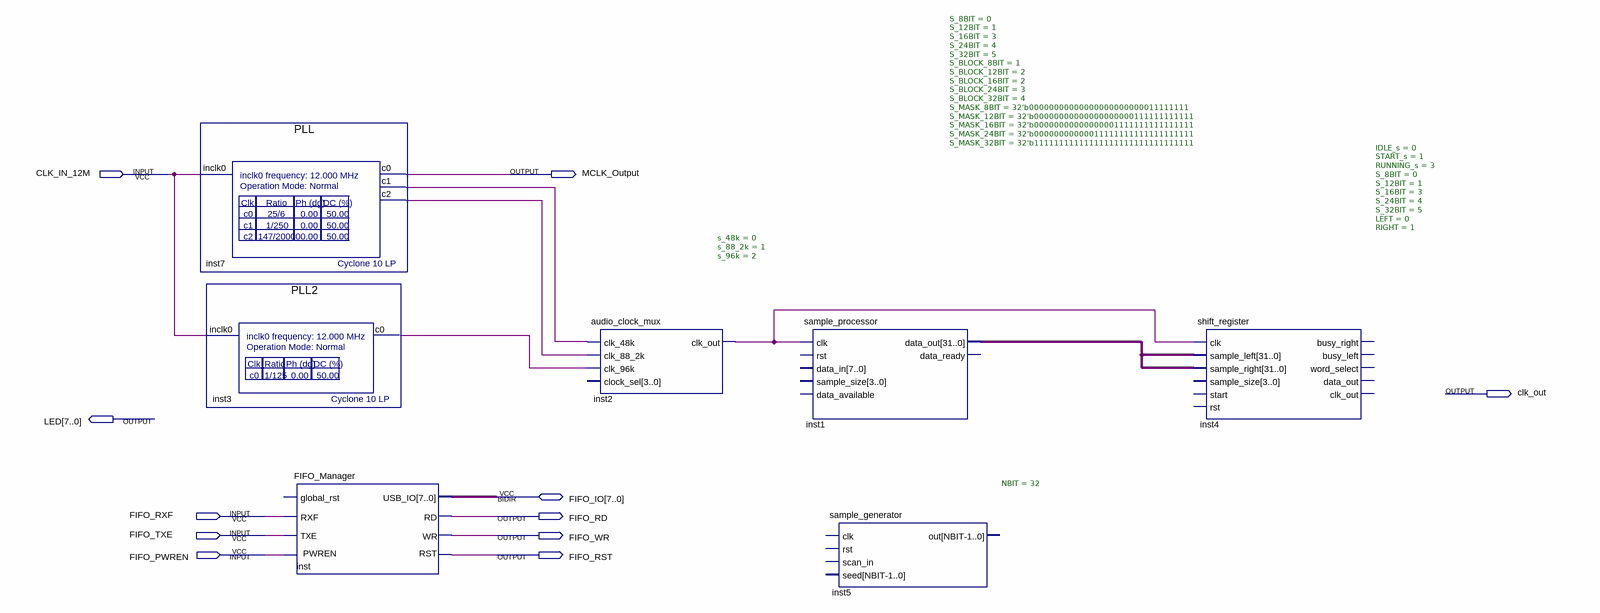
[diagram p0: schematic sheet]
// Quartus schematic USB-to-I2S-Converter.bdf as structural Verilog: 7 symbols, 11 pins
module \USB-to-I2S-Converter  (
  input  CLK_IN_12M,
  input  FIFO_RXF,
  input  FIFO_TXE,
  input  FIFO_PWREN,
  inout  [7:0] FIFO_IO,
  output MCLK_Output,
  output clk_out,
  output [7:0] LED,
  output FIFO_RD,
  output FIFO_WR,
  output FIFO_RST
);

  wire inst2_clk_out, inst3_c0, inst7_c1, inst7_c2;
  wire [31:0] inst1_data_out;

  PLL inst7 (.inclk0(CLK_IN_12M), .c0(MCLK_Output), .c1(inst7_c1), .c2(inst7_c2));
  PLL2 inst3 (.inclk0(CLK_IN_12M), .c0(inst3_c0));
  FIFO_Manager inst (
    .RXF(FIFO_RXF), .TXE(FIFO_TXE), .PWREN(FIFO_PWREN), .RD(FIFO_RD), .WR(FIFO_WR), .RST(FIFO_RST),
    .USB_IO(FIFO_IO));  // open: global_rst
  audio_clock_mux #(.s_48k(0), .s_88_2k(1), .s_96k(2)) inst2 (
    .clk_48k(inst7_c1), .clk_88_2k(inst7_c2), .clk_96k(inst3_c0), .clk_out(inst2_clk_out));  // open: clock_sel
  sample_processor #(.S_8BIT(0), .S_12BIT(1), .S_16BIT(3), .S_24BIT(4), .S_32BIT(5), .S_BLOCK_8BIT(1), .S_BLOCK_12BIT(2), .S_BLOCK_16BIT(2), .S_BLOCK_24BIT(3), .S_BLOCK_32BIT(4), .S_MASK_8BIT(32'b00000000000000000000000011111111), .S_MASK_12BIT(32'b00000000000000000000111111111111), .S_MASK_16BIT(32'b00000000000000001111111111111111), .S_MASK_24BIT(32'b00000000000011111111111111111111), .S_MASK_32BIT(32'b11111111111111111111111111111111)) inst1 (
    .clk(inst2_clk_out), .data_out(inst1_data_out));  // open: rst, data_in, sample_size, data_available, data_ready
  sample_generator #(.NBIT(32)) inst5 ();  // open: clk, rst, scan_in, seed, out
  shift_register #(.IDLE_s(0), .START_s(1), .RUNNING_s(3), .S_8BIT(0), .S_12BIT(1), .S_16BIT(3), .S_24BIT(4), .S_32BIT(5), .LEFT(0), .RIGHT(1)) inst4 (
    .clk(inst2_clk_out), .sample_left(inst1_data_out), .sample_right(inst1_data_out));  // open: sample_size, start, rst, busy_right, busy_left, word_select, data_out, clk_out
endmodule
